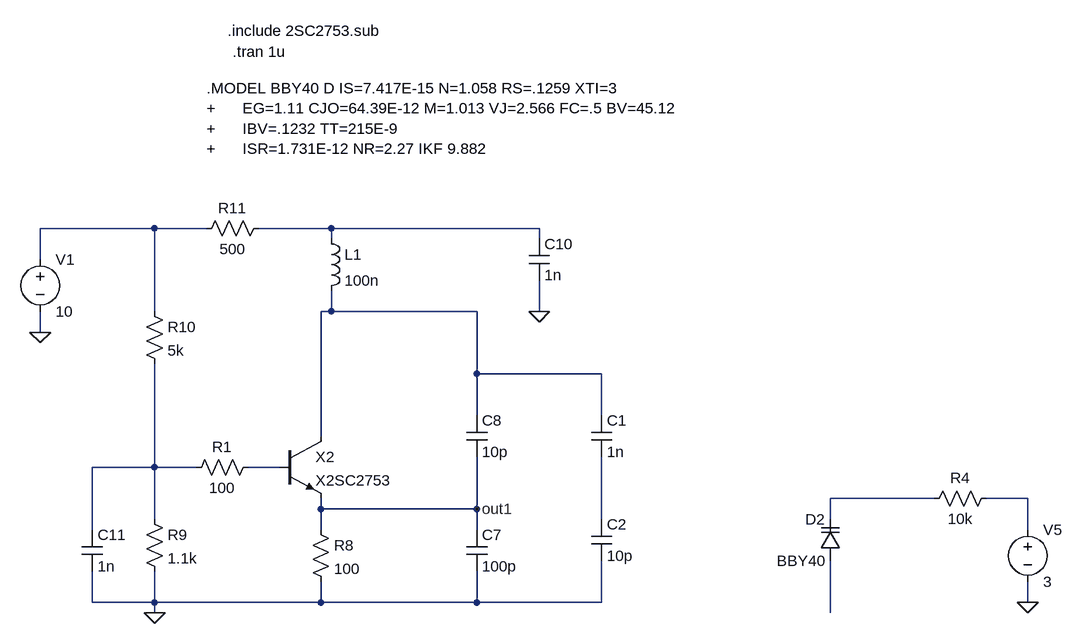
[diagram p0: schematic oscillator.asc]
oscillator.asc, the LTspice schematic file:
Version 4
SHEET 1 1772 2164
WIRE 240 416 64 416
WIRE 320 416 240 416
WIRE 512 416 400 416
WIRE 832 416 512 416
WIRE 512 432 512 416
WIRE 832 432 832 416
WIRE 64 464 64 416
WIRE 240 544 240 416
WIRE 512 544 512 512
WIRE 512 544 496 544
WIRE 736 544 512 544
WIRE 832 544 832 496
WIRE 64 576 64 544
WIRE 736 640 736 544
WIRE 928 640 736 640
WIRE 736 704 736 640
WIRE 928 704 928 640
WIRE 496 736 496 544
WIRE 240 784 240 624
WIRE 240 784 144 784
WIRE 304 784 240 784
WIRE 432 784 384 784
WIRE 1440 832 1280 832
WIRE 1584 832 1520 832
WIRE 496 848 496 832
WIRE 736 848 736 768
WIRE 736 848 496 848
WIRE 240 864 240 784
WIRE 928 864 928 768
WIRE 1280 864 1280 832
WIRE 144 880 144 784
WIRE 496 880 496 848
WIRE 736 880 736 848
WIRE 1584 880 1584 832
WIRE 144 992 144 944
WIRE 240 992 240 944
WIRE 240 992 144 992
WIRE 496 992 496 960
WIRE 496 992 240 992
WIRE 736 992 736 944
WIRE 736 992 496 992
WIRE 928 992 928 928
WIRE 928 992 736 992
WIRE 1584 992 1584 960
WIRE 240 1008 240 992
WIRE 1280 1008 1280 928
FLAG 1584 992 0
FLAG 240 1008 0
FLAG 64 576 0
FLAG 736 848 out1
FLAG 832 544 0
SYMBOL res 1536 816 R90
WINDOW 0 0 56 VBottom 2
WINDOW 3 32 56 VTop 2
SYMATTR InstName R4
SYMATTR Value 10k
SYMBOL voltage 1584 864 R0
WINDOW 123 0 0 Left 0
WINDOW 39 0 0 Left 0
SYMATTR InstName V5
SYMATTR Value 3
SYMBOL varactor 1296 928 R180
WINDOW 0 24 64 Left 2
WINDOW 3 24 0 Left 2
SYMATTR InstName D2
SYMATTR Value BBY40
SYMBOL npn 432 736 R0
SYMATTR InstName X2
SYMATTR Value X2SC2753
SYMATTR Prefix X
SYMBOL cap 720 880 R0
SYMATTR InstName C7
SYMATTR Value 100p
SYMBOL ind 496 416 R0
SYMATTR InstName L1
SYMATTR Value 100n
SYMBOL voltage 64 448 R0
WINDOW 123 0 0 Left 0
WINDOW 39 0 0 Left 0
SYMATTR InstName V1
SYMATTR Value 10
SYMBOL cap 720 704 R0
SYMATTR InstName C8
SYMATTR Value 10p
SYMBOL res 480 864 R0
SYMATTR InstName R8
SYMATTR Value 100
SYMBOL res 224 848 R0
SYMATTR InstName R9
SYMATTR Value 1.1k
SYMBOL res 224 528 R0
SYMATTR InstName R10
SYMATTR Value 5k
SYMBOL res 416 400 R90
WINDOW 0 0 56 VBottom 2
WINDOW 3 32 56 VTop 2
SYMATTR InstName R11
SYMATTR Value 500
SYMBOL cap 816 432 R0
SYMATTR InstName C10
SYMATTR Value 1n
SYMBOL cap 128 880 R0
SYMATTR InstName C11
SYMATTR Value 1n
SYMBOL res 400 768 R90
WINDOW 0 0 56 VBottom 2
WINDOW 3 32 56 VTop 2
SYMATTR InstName R1
SYMATTR Value 100
SYMBOL cap 912 704 R0
SYMATTR InstName C1
SYMATTR Value 1n
SYMBOL cap 912 864 R0
SYMATTR InstName C2
SYMATTR Value 10p
TEXT 352 112 Left 2 !.include 2SC2753.sub
TEXT 360 144 Left 2 !.tran 1u
TEXT 320 200 Left 2 !.MODEL BBY40 D IS=7.417E-15 N=1.058 RS=.1259 XTI=3 \n+      EG=1.11 CJO=64.39E-12 M=1.013 VJ=2.566 FC=.5 BV=45.12 \n+      IBV=.1232 TT=215E-9\n+      ISR=1.731E-12 NR=2.27 IKF 9.882

The netlist it stands for:
* oscillator.asc
R4 N007 N006 10k
V5 N007 0 3
D2 N009 N006 BBY40
XX2 N003 N005 out1 X2SC2753  ; pins C B E
C7 out1 0 100p
L1 N002 N003 100n
V1 N001 0 10
C8 N003 out1 10p
R8 out1 0 100
R9 N004 0 1.1k
R10 N001 N004 5k
R11 N002 N001 500
C10 N002 0 1n
C11 N004 0 1n
R1 N005 N004 100
C1 N003 N008 1n
C2 N008 0 10p
.model D D
.lib standard.dio
.include 2SC2753.sub
.tran 1u
.MODEL BBY40 D IS=7.417E-15 N=1.058 RS=.1259 XTI=3
+      EG=1.11 CJO=64.39E-12 M=1.013 VJ=2.566 FC=.5 BV=45.12
+      IBV=.1232 TT=215E-9
+      ISR=1.731E-12 NR=2.27 IKF 9.882
.backanno
.end